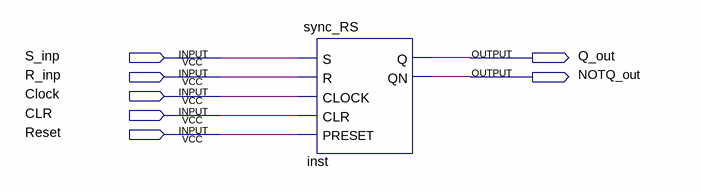
[diagram p0: schematic sheet]
// Quartus schematic sync_RS_shema.bdf as structural Verilog: 1 symbols, 7 pins
module sync_RS_shema (
  input  S_inp,
  input  R_inp,
  input  Clock,
  input  CLR,
  input  Reset,
  output Q_out,
  output NOTQ_out
);

  sync_RS inst (.S(S_inp), .R(R_inp), .CLOCK(Clock), .CLR(CLR), .PRESET(Reset), .Q(Q_out), .QN(NOTQ_out));
endmodule
